# Altium project MainBoard.PrjPcb
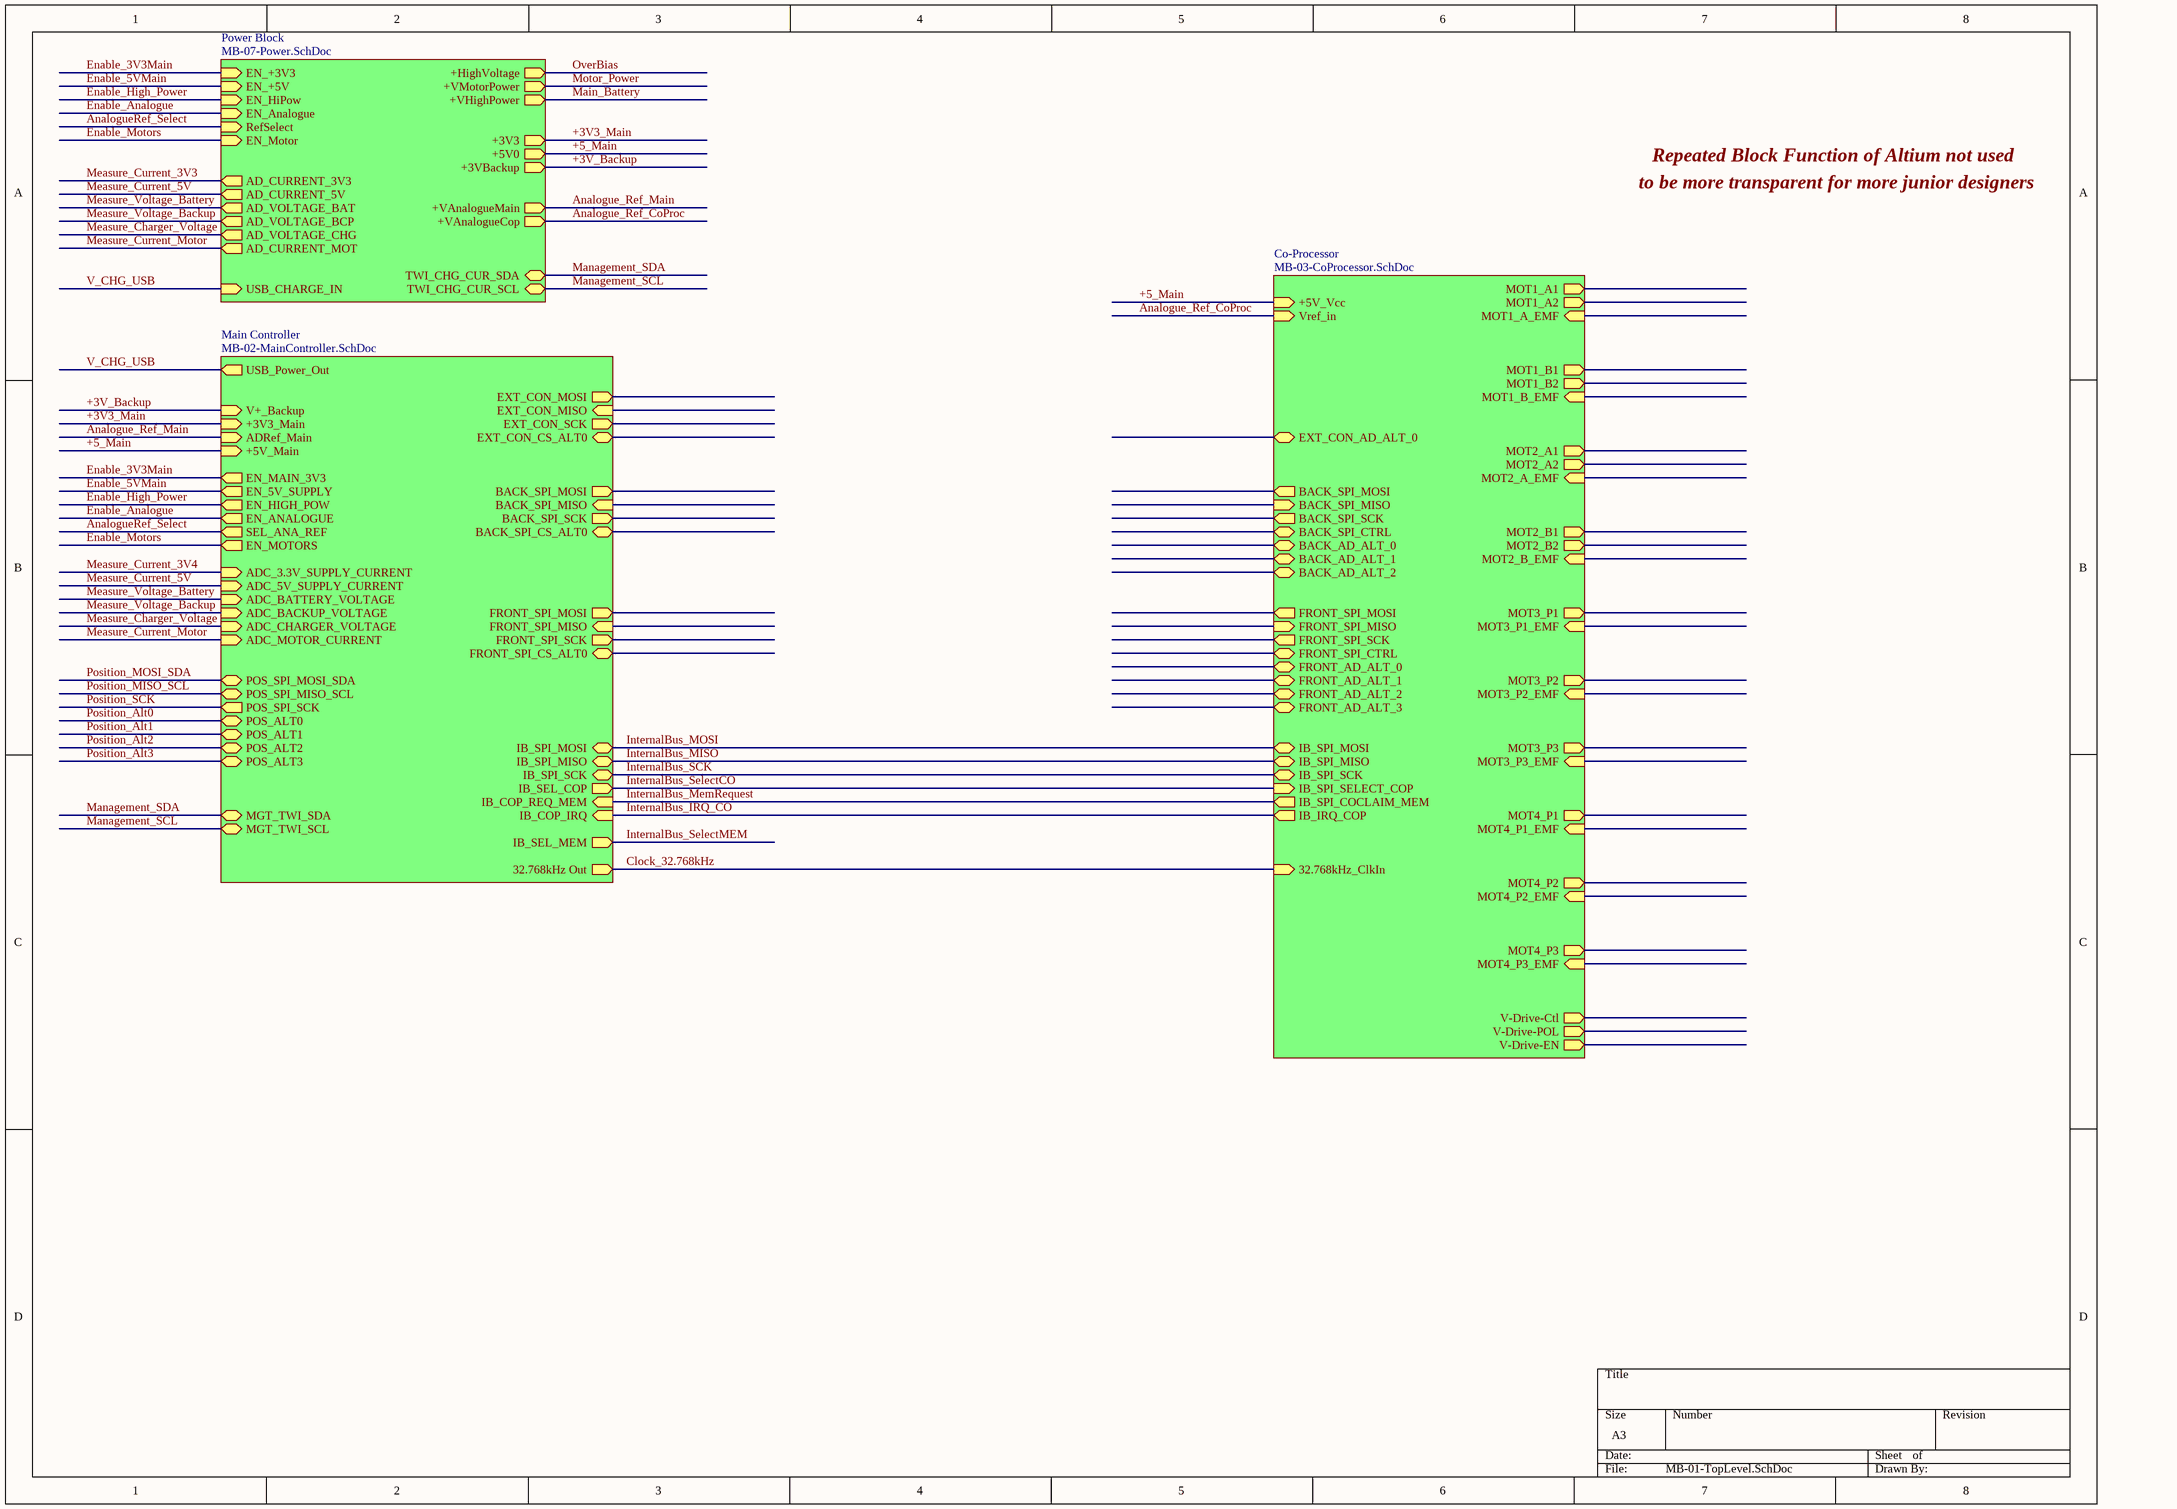
[diagram p0: MB-01-TopLevel.SchDoc]
13 sheets, 8 parts. Net scope: hierarchical (ports join the sheet entries above them; power ports are global).
Board file: MainBoard.PcbDoc
Sheets:
  MB-01-TopLevel.SchDoc
    Main Controller = MB-02-MainController.SchDoc
      USB-C-Connector = MB-06-USB-C.SchDoc
    Co-Processor = MB-03-CoProcessor.SchDoc
    Power Block = MB-07-Power.SchDoc
  MB-04-PositionSensors.SchDoc
  MB-05-FrontBay.SchDoc
  MB-08-Mot-Two_phase.SchDoc
    Phase A1 = MB-10-PhaseDrive-LowPow.SchDoc
    Phase A2 = MB-10-PhaseDrive-LowPow.SchDoc
    Phase B1 = MB-10-PhaseDrive-LowPow.SchDoc
    Phase B2 = MB-10-PhaseDrive-LowPow.SchDoc
  MB-09-Mot-Three_phase.SchDoc
    Phase 1 = MB-11-PhaseDrive-HiPow.SchDoc
    Phase 2 = MB-11-PhaseDrive-HiPow.SchDoc
    Phase 3 = MB-11-PhaseDrive-HiPow.SchDoc
  MB-12-BackBay.SchDoc
  MB-13-EXTCon.SchDoc

## Sheet MB-01-TopLevel.SchDoc
size A3

### Sub-sheets
Co-Processor = MB-03-CoProcessor.SchDoc: BACK_AD_ALT_1 (bidir), EXT_CON_AD_ALT_0 (bidir), BACK_AD_ALT_2 (bidir), BACK_AD_ALT_0 (bidir), FRONT_AD_ALT_3 (bidir), FRONT_AD_ALT_2 (bidir), FRONT_AD_ALT_1 (bidir), FRONT_AD_ALT_0 (bidir), BACK_SPI_SCK (out), BACK_SPI_MISO (in), BACK_SPI_MOSI (out), BACK_SPI_CTRL (bidir), FRONT_SPI_CTRL (bidir), FRONT_SPI_SCK (out), FRONT_SPI_MISO (in), FRONT_SPI_MOSI (out), +5V_Vcc (in), Vref_in (in), V-Drive-POL (out), V-Drive-EN (out), V-Drive-Ctl (out), MOT4_P3 (out), MOT4_P2 (out), MOT4_P1 (out), MOT3_P3 (out), MOT3_P2 (out), MOT3_P1 (out), MOT2_A1 (out), MOT1_B2 (out), MOT2_B2 (out), MOT2_B1 (out), MOT2_A2 (out), MOT1_B1 (out), MOT1_A2 (out), MOT1_A1 (out), 32.768kHz_ClkIn (in), IB_SPI_COCLAIM_MEM (out), IB_IRQ_COP (out), IB_SPI_SCK (bidir), IB_SPI_SELECT_COP (in), IB_SPI_MISO (bidir), IB_SPI_MOSI (bidir), MOT1_B_EMF (in), MOT1_A_EMF (in), MOT2_B_EMF (in), MOT3_P1_EMF (in), MOT2_A_EMF (in), MOT3_P2_EMF (in), MOT3_P3_EMF (in), MOT4_P1_EMF (in), MOT4_P2_EMF (in), MOT4_P3_EMF (in)
Main Controller = MB-02-MainController.SchDoc: ADC_BATTERY_VOLTAGE (in), BACK_SPI_SCK (out), USB_Power_Out (out), V+_Backup (in), +3V3_Main (in), ADRef_Main (in), ADC_MOTOR_CURRENT (in), +5V_Main (in), EXT_CON_SCK (out), EXT_CON_CS_ALT0 (bidir), EXT_CON_MOSI (out), EXT_CON_MISO (in), BACK_SPI_CS_ALT0 (bidir), BACK_SPI_MISO (in), BACK_SPI_MOSI (out), 32.768kHz Out (out), FRONT_SPI_SCK (out), FRONT_SPI_CS_ALT0 (bidir), FRONT_SPI_MOSI (out), FRONT_SPI_MISO (in), IB_COP_REQ_MEM (in), IB_SEL_MEM (out), IB_COP_IRQ (in), IB_SEL_COP (out), IB_SPI_MISO (bidir), IB_SPI_MOSI (bidir), IB_SPI_SCK (bidir), POS_ALT2 (bidir), POS_ALT3 (bidir), POS_ALT0 (bidir), POS_ALT1 (bidir), SEL_ANA_REF (out), EN_5V_SUPPLY (out), POS_SPI_MISO_SCL (bidir), POS_SPI_SCK (out), EN_HIGH_POW (out), POS_SPI_MOSI_SDA (bidir), EN_ANALOGUE (out), EN_MOTORS (out), ADC_3.3V_SUPPLY_CURRENT (in), ADC_BACKUP_VOLTAGE (in), ADC_CHARGER_VOLTAGE (in), EN_MAIN_3V3 (out), ADC_5V_SUPPLY_CURRENT (in), MGT_TWI_SDA (bidir), MGT_TWI_SCL (bidir)
Power Block = MB-07-Power.SchDoc: +VHighPower (out), EN_Motor (in), EN_Analogue (in), +VMotorPower (out), +3V3 (out), RefSelect (in), +5V0 (out), EN_+5V (in), +VAnalogueCop (out), +VAnalogueMain (out), +HighVoltage (out), EN_+3V3 (in), EN_HiPow (in), AD_VOLTAGE_BCP (out), USB_CHARGE_IN (in), AD_CURRENT_3V3 (out), AD_CURRENT_MOT (out), AD_CURRENT_5V (out), AD_VOLTAGE_BAT (out), AD_VOLTAGE_CHG (out), TWI_CHG_CUR_SCL (bidir), TWI_CHG_CUR_SDA (bidir), +3VBackup (out)

### Nets
+3V3_Main: sheet Main Controller/+3V3_Main, sheet Power Block/+3V3
+3V_Backup: sheet Main Controller/V+_Backup, sheet Power Block/+3VBackup
+5_Main: sheet Main Controller/+5V_Main, sheet Co-Processor/+5V_Vcc, sheet Power Block/+5V0
Analogue_Ref_CoProc: sheet Co-Processor/Vref_in, sheet Power Block/+VAnalogueCop
Analogue_Ref_Main: sheet Main Controller/ADRef_Main, sheet Power Block/+VAnalogueMain
AnalogueRef_Select: sheet Main Controller/SEL_ANA_REF, sheet Power Block/RefSelect
Clock_32.768kHz: sheet Main Controller/32.768kHz Out, sheet Co-Processor/32.768kHz_ClkIn  [project net 32.768kHz Bus]
Enable_3V3Main: sheet Main Controller/EN_MAIN_3V3, sheet Power Block/EN_+3V3
Enable_5VMain: sheet Main Controller/EN_5V_SUPPLY, sheet Power Block/EN_+5V
Enable_Analogue: sheet Main Controller/EN_ANALOGUE, sheet Power Block/EN_Analogue
Enable_High_Power: sheet Main Controller/EN_HIGH_POW, sheet Power Block/EN_HiPow
Enable_Motors: sheet Main Controller/EN_MOTORS, sheet Power Block/EN_Motor
InternalBus_IRQ_CO: sheet Main Controller/IB_COP_IRQ, sheet Co-Processor/IB_IRQ_COP
InternalBus_MemRequest: sheet Main Controller/IB_COP_REQ_MEM, sheet Co-Processor/IB_SPI_COCLAIM_MEM
InternalBus_MISO: sheet Main Controller/IB_SPI_MISO, sheet Co-Processor/IB_SPI_MISO
InternalBus_MOSI: sheet Main Controller/IB_SPI_MOSI, sheet Co-Processor/IB_SPI_MOSI
InternalBus_SCK: sheet Main Controller/IB_SPI_SCK, sheet Co-Processor/IB_SPI_SCK
InternalBus_SelectCO: sheet Main Controller/IB_SEL_COP, sheet Co-Processor/IB_SPI_SELECT_COP
Main_Battery: sheet Power Block/+VHighPower
Management_SCL: sheet Main Controller/MGT_TWI_SCL, sheet Power Block/TWI_CHG_CUR_SCL
Management_SDA: sheet Main Controller/MGT_TWI_SDA, sheet Power Block/TWI_CHG_CUR_SDA
Measure_Charger_Voltage: sheet Main Controller/ADC_CHARGER_VOLTAGE, sheet Power Block/AD_VOLTAGE_CHG
Measure_Current_3V3: sheet Power Block/AD_CURRENT_3V3
Measure_Current_5V: sheet Main Controller/ADC_5V_SUPPLY_CURRENT, sheet Power Block/AD_CURRENT_5V
Measure_Current_Motor: sheet Main Controller/ADC_MOTOR_CURRENT, sheet Power Block/AD_CURRENT_MOT
Measure_Voltage_Backup: sheet Main Controller/ADC_BACKUP_VOLTAGE, sheet Power Block/AD_VOLTAGE_BCP
Measure_Voltage_Battery: sheet Main Controller/ADC_BATTERY_VOLTAGE, sheet Power Block/AD_VOLTAGE_BAT
Motor_Power: sheet Power Block/+VMotorPower
OverBias: sheet Power Block/+HighVoltage
V_CHG_USB: sheet Main Controller/USB_Power_Out, sheet Power Block/USB_CHARGE_IN

### Notes on the sheet
- Repeated Block Function of Altium not used
- to be more transparent for more junior designers

## Sheet MB-02-MainController.SchDoc
size 330 x 228 mm
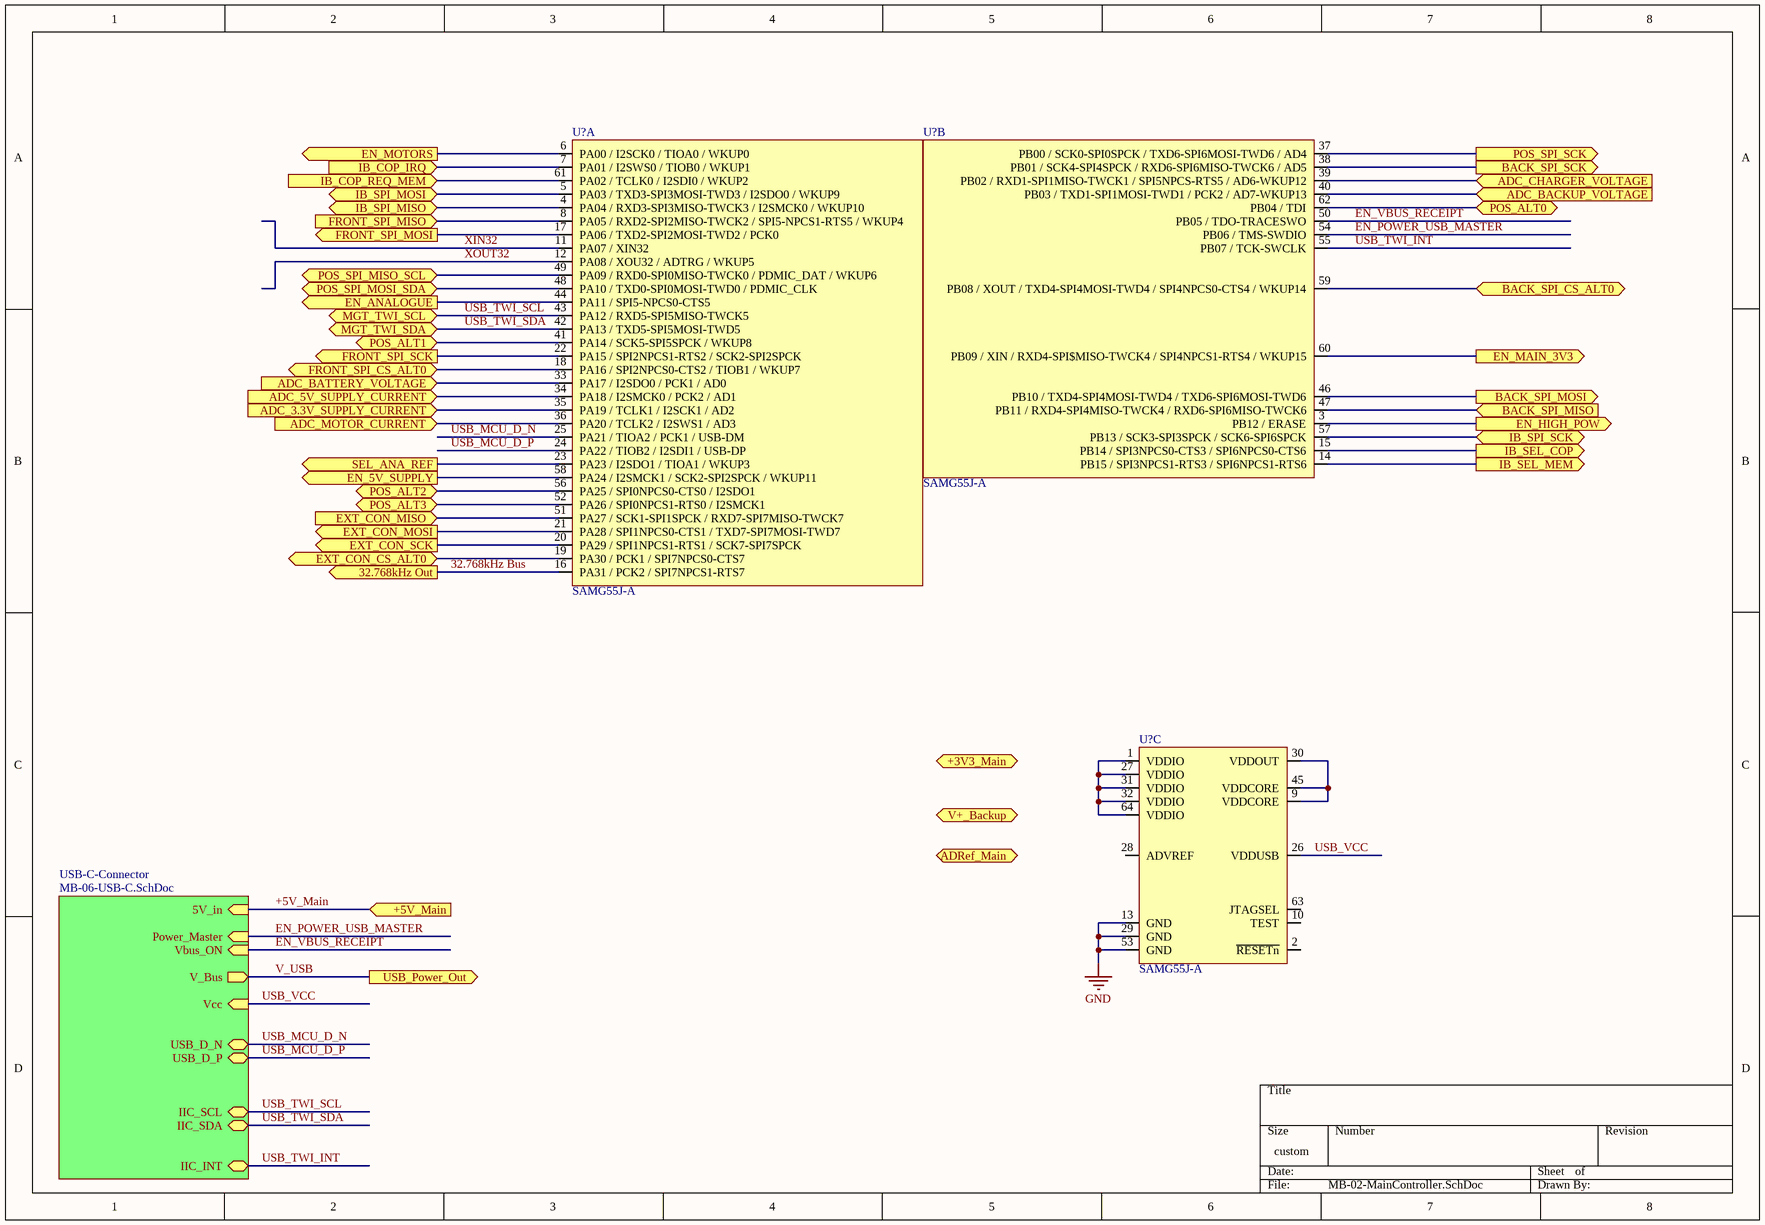
[diagram p1: MB-02-MainController.SchDoc]

### Parts
(Parts that share a designator on the sheet are numbered #1, #2 ... from top to bottom, then left to right.)
U?#1  SAMG55J-A  (part A of 3)
U?#2  SAMG55J-A  (part B of 3)
U?#3  SAMG55J-A  (part C of 3)

### Sub-sheets
USB-C-Connector = MB-06-USB-C.SchDoc: USB_D_P (bidir), USB_D_N (bidir), IIC_SCL (bidir), IIC_SDA (bidir), IIC_INT (bidir), V_Bus (out), Vcc (in), 5V_in (in), Power_Master (in), Vbus_ON (in)

### Ports
32.768kHz Out (out), +3V3_Main (in), +5V_Main (in), ADC_3.3V_SUPPLY_CURRENT (in), ADC_5V_SUPPLY_CURRENT (in), ADC_BACKUP_VOLTAGE (in), ADC_BATTERY_VOLTAGE (in), ADC_CHARGER_VOLTAGE (in), ADC_MOTOR_CURRENT (in), ADRef_Main (in), BACK_SPI_CS_ALT0 (bidir), BACK_SPI_MISO (in), BACK_SPI_MOSI (out), BACK_SPI_SCK (out), EN_5V_SUPPLY (out), EN_ANALOGUE (out), EN_HIGH_POW (out), EN_MAIN_3V3 (out), EN_MOTORS (out), EXT_CON_CS_ALT0 (bidir), EXT_CON_MISO (in), EXT_CON_MOSI (out), EXT_CON_SCK (out), FRONT_SPI_CS_ALT0 (bidir), FRONT_SPI_MISO (in), FRONT_SPI_MOSI (out), FRONT_SPI_SCK (out), IB_COP_IRQ (in), IB_COP_REQ_MEM (in), IB_SEL_COP (out), IB_SEL_MEM (out), IB_SPI_MISO (bidir), IB_SPI_MOSI (bidir), IB_SPI_SCK (bidir), MGT_TWI_SCL (bidir), MGT_TWI_SDA (bidir), POS_ALT0 (bidir), POS_ALT1 (bidir), POS_ALT2 (bidir), POS_ALT3 (bidir), POS_SPI_MISO_SCL (bidir), POS_SPI_MOSI_SDA (bidir), POS_SPI_SCK (out), SEL_ANA_REF (out), USB_Power_Out (out), V+_Backup (in)

### Nets
GND: U?#3.13(GND) U?#3.29(GND) U?#3.53(GND)
32.768kHz Bus: U?#1.16(PA31_/_PCK2_/_SPI7NPCS1-RTS7) ; port 32.768kHz Out
+5V_Main: port +5V_Main, sheet USB-C-Connector/5V_in  [project net +5_Main]
AnalogueRef_Select: U?#1.23(PA23_/_I2SDO1_/_TIOA1_/_WKUP3) ; port SEL_ANA_REF
EN_POWER_USB_MASTER: U?#2.54(PB06_/_TMS-SWDIO) ; sheet USB-C-Connector/Power_Master
EN_VBUS_RECEIPT: U?#2.50(PB05_/_TDO-TRACESWO) ; sheet USB-C-Connector/Vbus_ON
Enable_3V3Main: U?#2.60(PB09_/_XIN_/_RXD4-SPI$MISO-TWCK4_/_SPI4NPCS1-RTS4_/_WKUP15) ; port EN_MAIN_3V3
Enable_5VMain: U?#1.58(PA24_/_I2SMCK1_/_SCK2-SPI2SPCK_/_WKUP11) ; port EN_5V_SUPPLY
Enable_Analogue: U?#1.44(PA11_/_SPI5-NPCS0-CTS5) ; port EN_ANALOGUE
Enable_High_Power: U?#2.3(PB12_/_ERASE) ; port EN_HIGH_POW
Enable_Motors: U?#1.6(PA00_/_I2SCK0_/_TIOA0_/_WKUP0) ; port EN_MOTORS
InternalBus_IRQ_CO: U?#1.7(PA01_/_I2SWS0_/_TIOB0_/_WKUP1) ; port IB_COP_IRQ
InternalBus_MemRequest: U?#1.61(PA02_/_TCLK0_/_I2SDI0_/_WKUP2) ; port IB_COP_REQ_MEM
InternalBus_MISO: U?#1.4(PA04_/_RXD3-SPI3MISO-TWCK3_/_I2SMCK0_/_WKUP10) ; port IB_SPI_MISO
InternalBus_MOSI: U?#1.5(PA03_/_TXD3-SPI3MOSI-TWD3_/_I2SDO0_/_WKUP9) ; port IB_SPI_MOSI
InternalBus_SCK: U?#2.57(PB13_/_SCK3-SPI3SPCK_/_SCK6-SPI6SPCK) ; port IB_SPI_SCK
InternalBus_SelectCO: U?#2.15(PB14_/_SPI3NPCS0-CTS3_/_SPI6NPCS0-CTS6) ; port IB_SEL_COP
InternalBus_SelectMEM: U?#2.14(PB15_/_SPI3NPCS1-RTS3_/_SPI6NPCS1-RTS6) ; port IB_SEL_MEM
Measure_Charger_Voltage: U?#2.39(PB02_/_RXD1-SPI1MISO-TWCK1_/_SPI5NPCS-RTS5_/_AD6-WKUP12) ; port ADC_CHARGER_VOLTAGE
Measure_Current_3V4: U?#1.35(PA19_/_TCLK1_/_I2SCK1_/_AD2) ; port ADC_3.3V_SUPPLY_CURRENT
Measure_Current_5V: U?#1.34(PA18_/_I2SMCK0_/_PCK2_/_AD1) ; port ADC_5V_SUPPLY_CURRENT
Measure_Current_Motor: U?#1.36(PA20_/_TCLK2_/_I2SWS1_/_AD3) ; port ADC_MOTOR_CURRENT
Measure_Voltage_Backup: U?#2.40(PB03_/_TXD1-SPI1MOSI-TWD1_/_PCK2_/_AD7-WKUP13) ; port ADC_BACKUP_VOLTAGE
Measure_Voltage_Battery: U?#1.33(PA17_/_I2SDO0_/_PCK1_/_AD0) ; port ADC_BATTERY_VOLTAGE
Position_Alt0: U?#2.62(PB04_/_TDI) ; port POS_ALT0
Position_Alt1: U?#1.41(PA14_/_SCK5-SPI5SPCK_/_WKUP8) ; port POS_ALT1
Position_Alt2: U?#1.56(PA25_/_SPI0NPCS0-CTS0_/_I2SDO1) ; port POS_ALT2
Position_Alt3: U?#1.52(PA26_/_SPI0NPCS1-RTS0_/_I2SMCK1) ; port POS_ALT3
Position_MISO_SCL: U?#1.49(PA09_/_RXD0-SPI0MISO-TWCK0_/_PDMIC_DAT_/_WKUP6) ; port POS_SPI_MISO_SCL
Position_MOSI_SDA: U?#1.48(PA10_/_TXD0-SPI0MOSI-TWD0_/_PDMIC_CLK) ; port POS_SPI_MOSI_SDA
Position_SCK: U?#2.37(PB00_/_SCK0-SPI0SPCK_/_TXD6-SPI6MOSI-TWD6_/_AD4) ; port POS_SPI_SCK
USB_MCU_D_N: U?#1.25(PA21_/_TIOA2_/_PCK1_/_USB-DM) ; sheet USB-C-Connector/USB_D_N
USB_MCU_D_P: U?#1.24(PA22_/_TIOB2_/_I2SDI1_/_USB-DP) ; sheet USB-C-Connector/USB_D_P
USB_TWI_INT: U?#2.55(PB07_/_TCK-SWCLK) ; sheet USB-C-Connector/IIC_INT
USB_TWI_SCL: U?#1.43(PA12_/_RXD5-SPI5MISO-TWCK5) ; port MGT_TWI_SCL, sheet USB-C-Connector/IIC_SCL  [project net Management_SCL]
USB_TWI_SDA: U?#1.42(PA13_/_TXD5-SPI5MOSI-TWD5) ; port MGT_TWI_SDA, sheet USB-C-Connector/IIC_SDA  [project net Management_SDA]
USB_VCC: U?#3.26(VDDUSB) ; sheet USB-C-Connector/Vcc
V_USB: port USB_Power_Out, sheet USB-C-Connector/V_Bus  [project net V_CHG_USB]
XIN32: U?#1.11(PA07_/_XIN32)
XOUT32: U?#1.12(PA08_/_XOU32_/_ADTRG_/_WKUP5)
NetU?#1_8: U?#1.8(PA05_/_RXD2-SPI2MISO-TWCK2_/_SPI5-NPCS1-RTS5_/_WKUP4) ; port FRONT_SPI_MISO
NetU?#1_17: U?#1.17(PA06_/_TXD2-SPI2MOSI-TWD2_/_PCK0) ; port FRONT_SPI_MOSI
NetU?#1_18: U?#1.18(PA16_/_SPI2NPCS0-CTS2_/_TIOB1_/_WKUP7) ; port FRONT_SPI_CS_ALT0
NetU?#1_19: U?#1.19(PA30_/_PCK1_/_SPI7NPCS0-CTS7) ; port EXT_CON_CS_ALT0
NetU?#1_20: U?#1.20(PA29_/_SPI1NPCS1-RTS1_/_SCK7-SPI7SPCK) ; port EXT_CON_SCK
NetU?#1_21: U?#1.21(PA28_/_SPI1NPCS0-CTS1_/_TXD7-SPI7MOSI-TWD7) ; port EXT_CON_MOSI
NetU?#1_22: U?#1.22(PA15_/_SPI2NPCS1-RTS2_/_SCK2-SPI2SPCK) ; port FRONT_SPI_SCK
NetU?#1_51: U?#1.51(PA27_/_SCK1-SPI1SPCK_/_RXD7-SPI7MISO-TWCK7) ; port EXT_CON_MISO
NetU?#2_38: U?#2.38(PB01_/_SCK4-SPI4SPCK_/_RXD6-SPI6MISO-TWCK6_/_AD5) ; port BACK_SPI_SCK
NetU?#2_46: U?#2.46(PB10_/_TXD4-SPI4MOSI-TWD4_/_TXD6-SPI6MOSI-TWD6) ; port BACK_SPI_MOSI
NetU?#2_47: U?#2.47(PB11_/_RXD4-SPI4MISO-TWCK4_/_RXD6-SPI6MISO-TWCK6) ; port BACK_SPI_MISO
NetU?#2_59: U?#2.59(PB08_/_XOUT_/_TXD4-SPI4MOSI-TWD4_/_SPI4NPCS0-CTS4_/_WKUP14) ; port BACK_SPI_CS_ALT0
NetU?#3_1: U?#3.1(VDDIO) U?#3.27(VDDIO) U?#3.31(VDDIO) U?#3.32(VDDIO) U?#3.64(VDDIO)
NetU?#3_9: U?#3.9(VDDCORE) U?#3.30(VDDOUT) U?#3.45(VDDCORE)

Not connected (* = marked no-connect by the designer): U?#3 2(~{RESETn}) 10(TEST) 28(ADVREF) 63(JTAGSEL)

### Library data of the parts
U?#1-U?#3 = CHIP_ATM_SAMG55J-A: Atmel ARM Cortex M4, 64pin QFP

## Sheet MB-06-USB-C.SchDoc
size A4
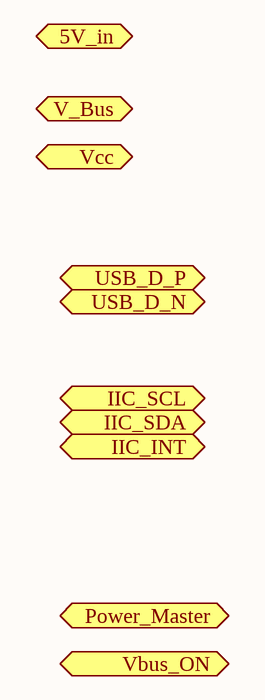
[diagram p2: MB-06-USB-C.SchDoc]

### Ports
5V_in (in), IIC_INT (bidir), IIC_SCL (bidir), IIC_SDA (bidir), Power_Master (in), USB_D_N (bidir), USB_D_P (bidir), V_Bus (out), Vbus_ON (in), Vcc (in)

## Sheet MB-03-CoProcessor.SchDoc
size 304 x 228 mm
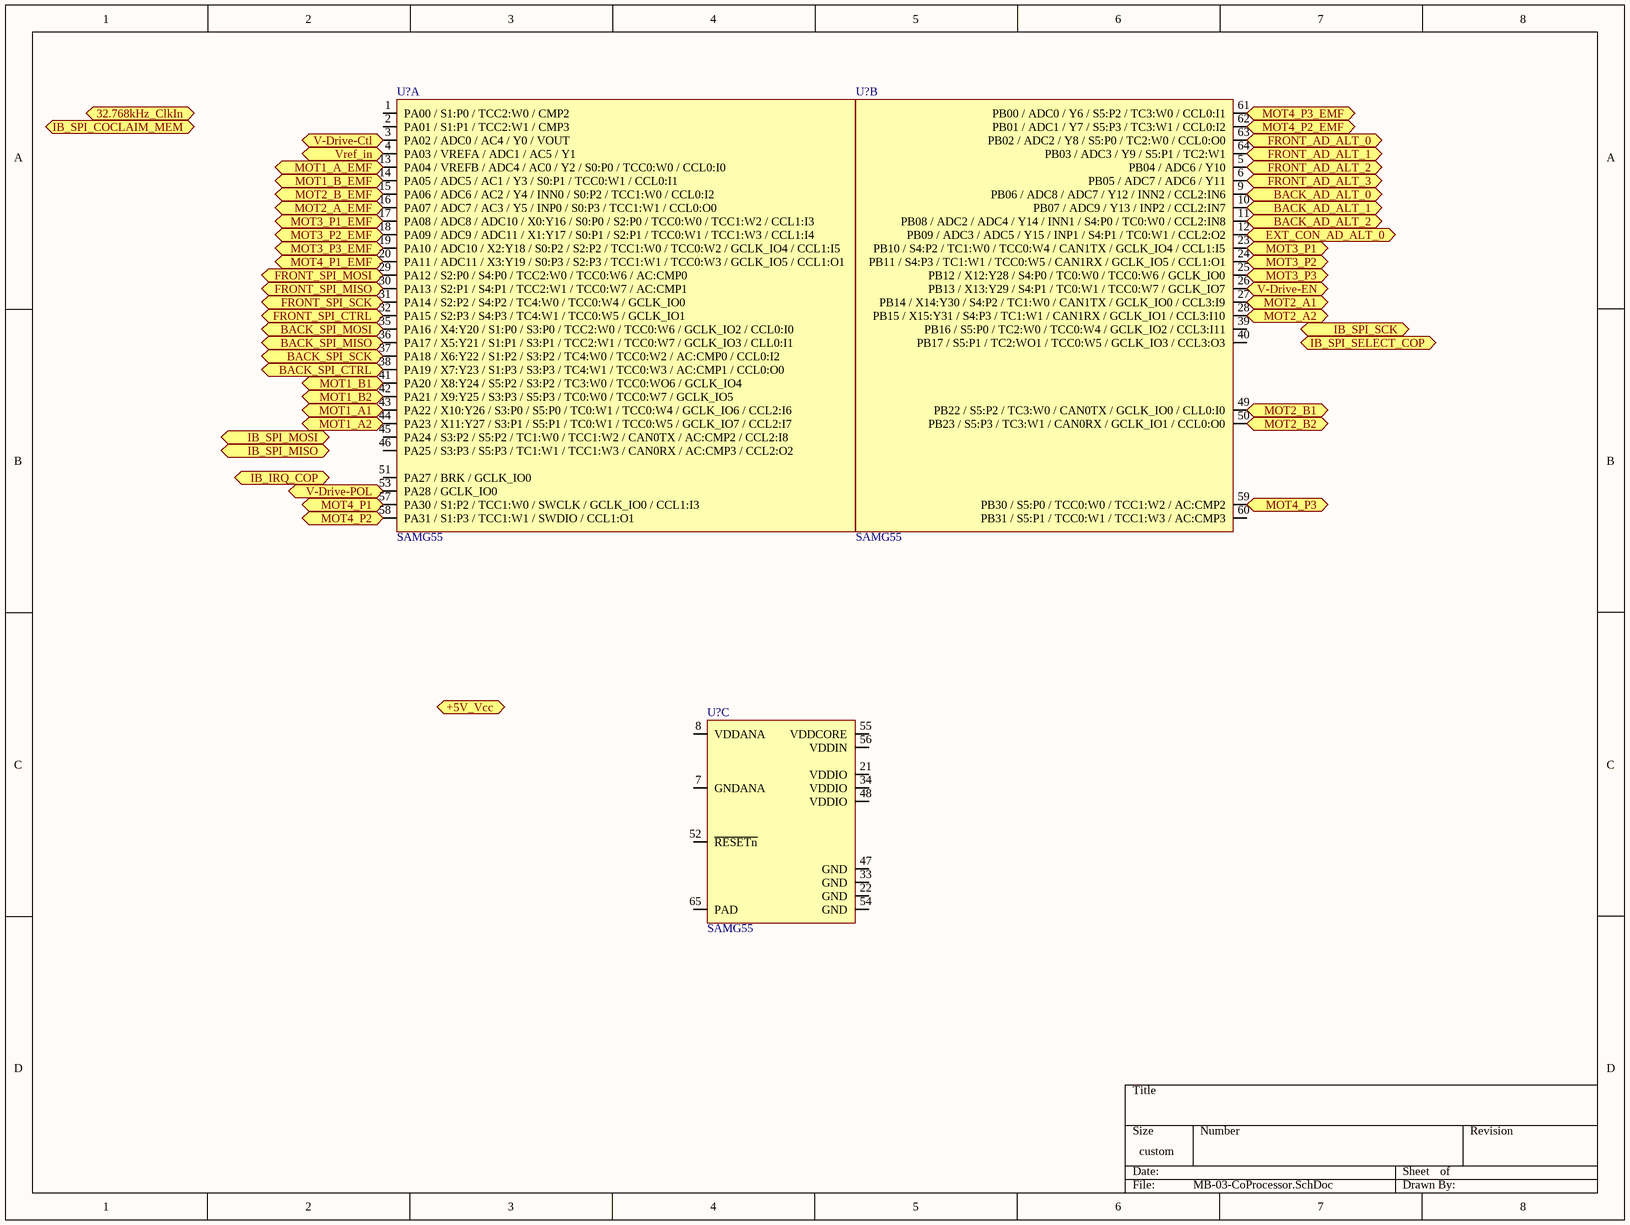
[diagram p3: MB-03-CoProcessor.SchDoc]

### Parts
(Parts that share a designator on the sheet are numbered #1, #2 ... from top to bottom, then left to right.)
U?#4  SAMG55  (part A of 3)
U?#5  SAMG55  (part B of 3)
U?#6  SAMG55  (part C of 3)

### Ports
32.768kHz_ClkIn (in), +5V_Vcc (in), BACK_AD_ALT_0 (bidir), BACK_AD_ALT_1 (bidir), BACK_AD_ALT_2 (bidir), BACK_SPI_CTRL (bidir), BACK_SPI_MISO (in), BACK_SPI_MOSI (out), BACK_SPI_SCK (out), EXT_CON_AD_ALT_0 (bidir), FRONT_AD_ALT_0 (bidir), FRONT_AD_ALT_1 (bidir), FRONT_AD_ALT_2 (bidir), FRONT_AD_ALT_3 (bidir), FRONT_SPI_CTRL (bidir), FRONT_SPI_MISO (in), FRONT_SPI_MOSI (out), FRONT_SPI_SCK (out), IB_IRQ_COP (out), IB_SPI_COCLAIM_MEM (out), IB_SPI_MISO (bidir), IB_SPI_MOSI (bidir), IB_SPI_SCK (bidir), IB_SPI_SELECT_COP (in), MOT1_A1 (out), MOT1_A2 (out), MOT1_A_EMF (in), MOT1_B1 (out), MOT1_B2 (out), MOT1_B_EMF (in), MOT2_A1 (out), MOT2_A2 (out), MOT2_A_EMF (in), MOT2_B1 (out), MOT2_B2 (out), MOT2_B_EMF (in), MOT3_P1 (out), MOT3_P1_EMF (in), MOT3_P2 (out), MOT3_P2_EMF (in), MOT3_P3 (out), MOT3_P3_EMF (in), MOT4_P1 (out), MOT4_P1_EMF (in), MOT4_P2 (out), MOT4_P2_EMF (in), MOT4_P3 (out), MOT4_P3_EMF (in), V-Drive-Ctl (out), V-Drive-EN (out), V-Drive-POL (out), Vref_in (in)

### Nets
Analogue_Ref_CoProc: U?#4.4(PA03_/_VREFA_/_ADC1_/_AC5_/_Y1) ; port Vref_in
NetU?#4_3: U?#4.3(PA02_/_ADC0_/_AC4_/_Y0_/_VOUT) ; port V-Drive-Ctl
NetU?#4_13: U?#4.13(PA04_/_VREFB_/_ADC4_/_AC0_/_Y2_/_S0:P0_/_TCC0:W0_/_CCL0:I0) ; port MOT1_A_EMF
NetU?#4_14: U?#4.14(PA05_/_ADC5_/_AC1_/_Y3_/_S0:P1_/_TCC0:W1_/_CCL0:I1) ; port MOT1_B_EMF
NetU?#4_15: U?#4.15(PA06_/_ADC6_/_AC2_/_Y4_/_INN0_/_S0:P2_/_TCC1:W0_/_CCL0:I2) ; port MOT2_B_EMF
NetU?#4_16: U?#4.16(PA07_/_ADC7_/_AC3_/_Y5_/_INP0_/_S0:P3_/_TCC1:W1_/_CCL0:O0) ; port MOT2_A_EMF
NetU?#4_17: U?#4.17(PA08_/_ADC8_/_ADC10_/_X0:Y16_/_S0:P0_/_S2:P0_/_TCC0:W0_/_TCC1:W2_/_CCL1:I3) ; port MOT3_P1_EMF
NetU?#4_18: U?#4.18(PA09_/_ADC9_/_ADC11_/_X1:Y17_/_S0:P1_/_S2:P1_/_TCC0:W1_/_TCC1:W3_/_CCL1:I4) ; port MOT3_P2_EMF
NetU?#4_19: U?#4.19(PA10_/_ADC10_/_X2:Y18_/_S0:P2_/_S2:P2_/_TCC1:W0_/_TCC0:W2_/_GCLK_IO4_/_CCL1:I5) ; port MOT3_P3_EMF
NetU?#4_20: U?#4.20(PA11_/_ADC11_/_X3:Y19_/_S0:P3_/_S2:P3_/_TCC1:W1_/_TCC0:W3_/_GCLK_IO5_/_CCL1:O1) ; port MOT4_P1_EMF
NetU?#4_29: U?#4.29(PA12_/_S2:P0_/_S4:P0_/_TCC2:W0_/_TCC0:W6_/_AC:CMP0) ; port FRONT_SPI_MOSI
NetU?#4_30: U?#4.30(PA13_/_S2:P1_/_S4:P1_/_TCC2:W1_/_TCC0:W7_/_AC:CMP1) ; port FRONT_SPI_MISO
NetU?#4_31: U?#4.31(PA14_/_S2:P2_/_S4:P2_/_TC4:W0_/_TCC0:W4_/_GCLK_IO0) ; port FRONT_SPI_SCK
NetU?#4_32: U?#4.32(PA15_/_S2:P3_/_S4:P3_/_TC4:W1_/_TCC0:W5_/_GCLK_IO1) ; port FRONT_SPI_CTRL
NetU?#4_35: U?#4.35(PA16_/_X4:Y20_/_S1:P0_/_S3:P0_/_TCC2:W0_/_TCC0:W6_/_GCLK_IO2_/_CCL0:I0) ; port BACK_SPI_MOSI
NetU?#4_36: U?#4.36(PA17_/_X5:Y21_/_S1:P1_/_S3:P1_/_TCC2:W1_/_TCC0:W7_/_GCLK_IO3_/_CLL0:I1) ; port BACK_SPI_MISO
NetU?#4_37: U?#4.37(PA18_/_X6:Y22_/_S1:P2_/_S3:P2_/_TC4:W0_/_TCC0:W2_/_AC:CMP0_/_CCL0:I2) ; port BACK_SPI_SCK
NetU?#4_38: U?#4.38(PA19_/_X7:Y23_/_S1:P3_/_S3:P3_/_TC4:W1_/_TCC0:W3_/_AC:CMP1_/_CCL0:O0) ; port BACK_SPI_CTRL
NetU?#4_41: U?#4.41(PA20_/_X8:Y24_/_S5:P2_/_S3:P2_/_TC3:W0_/_TCC0:WO6_/_GCLK_IO4) ; port MOT1_B1
NetU?#4_42: U?#4.42(PA21_/_X9:Y25_/_S3:P3_/_S5:P3_/_TC0:W0_/_TCC0:W7_/_GCLK_IO5) ; port MOT1_B2
NetU?#4_43: U?#4.43(PA22_/_X10:Y26_/_S3:P0_/_S5:P0_/_TC0:W1_/_TCC0:W4_/_GCLK_IO6_/_CCL2:I6) ; port MOT1_A1
NetU?#4_44: U?#4.44(PA23_/_X11:Y27_/_S3:P1_/_S5:P1_/_TC0:W1_/_TCC0:W5_/_GCLK_IO7_/_CCL2:I7) ; port MOT1_A2
NetU?#4_53: U?#4.53(PA28_/_GCLK_IO0) ; port V-Drive-POL
NetU?#4_57: U?#4.57(PA30_/_S1:P2_/_TCC1:W0_/_SWCLK_/_GCLK_IO0_/_CCL1:I3) ; port MOT4_P1
NetU?#4_58: U?#4.58(PA31_/_S1:P3_/_TCC1:W1_/_SWDIO_/_CCL1:O1) ; port MOT4_P2
NetU?#5_5: U?#5.5(PB04_/_ADC6_/_Y10) ; port FRONT_AD_ALT_2
NetU?#5_6: U?#5.6(PB05_/_ADC7_/_ADC6_/_Y11) ; port FRONT_AD_ALT_3
NetU?#5_9: U?#5.9(PB06_/_ADC8_/_ADC7_/_Y12_/_INN2_/_CCL2:IN6) ; port BACK_AD_ALT_0
NetU?#5_10: U?#5.10(PB07_/_ADC9_/_Y13_/_INP2_/_CCL2:IN7) ; port BACK_AD_ALT_1
NetU?#5_11: U?#5.11(PB08_/_ADC2_/_ADC4_/_Y14_/_INN1_/_S4:P0_/_TC0:W0_/_CCL2:IN8) ; port BACK_AD_ALT_2
NetU?#5_12: U?#5.12(PB09_/_ADC3_/_ADC5_/_Y15_/_INP1_/_S4:P1_/_TC0:W1_/_CCL2:O2) ; port EXT_CON_AD_ALT_0
NetU?#5_23: U?#5.23(PB10_/_S4:P2_/_TC1:W0_/_TCC0:W4_/_CAN1TX_/_GCLK_IO4_/_CCL1:I5) ; port MOT3_P1
NetU?#5_24: U?#5.24(PB11_/_S4:P3_/_TC1:W1_/_TCC0:W5_/_CAN1RX_/_GCLK_IO5_/_CCL1:O1) ; port MOT3_P2
NetU?#5_25: U?#5.25(PB12_/_X12:Y28_/_S4:P0_/_TC0:W0_/_TCC0:W6_/_GCLK_IO0) ; port MOT3_P3
NetU?#5_26: U?#5.26(PB13_/_X13:Y29_/_S4:P1_/_TC0:W1_/_TCC0:W7_/_GCLK_IO7) ; port V-Drive-EN
NetU?#5_27: U?#5.27(PB14_/_X14:Y30_/_S4:P2_/_TC1:W0_/_CAN1TX_/_GCLK_IO0_/_CCL3:I9) ; port MOT2_A1
NetU?#5_28: U?#5.28(PB15_/_X15:Y31_/_S4:P3_/_TC1:W1_/_CAN1RX_/_GCLK_IO1_/_CCL3:I10) ; port MOT2_A2
NetU?#5_49: U?#5.49(PB22_/_S5:P2_/_TC3:W0_/_CAN0TX_/_GCLK_IO0_/_CLL0:I0) ; port MOT2_B1
NetU?#5_50: U?#5.50(PB23_/_S5:P3_/_TC3:W1_/_CAN0RX_/_GCLK_IO1_/_CCL0:O0) ; port MOT2_B2
NetU?#5_59: U?#5.59(PB30_/_S5:P0_/_TCC0:W0_/_TCC1:W2_/_AC:CMP2) ; port MOT4_P3
NetU?#5_61: U?#5.61(PB00_/_ADC0_/_Y6_/_S5:P2_/_TC3:W0_/_CCL0:I1) ; port MOT4_P3_EMF
NetU?#5_62: U?#5.62(PB01_/_ADC1_/_Y7_/_S5:P3_/_TC3:W1_/_CCL0:I2) ; port MOT4_P2_EMF
NetU?#5_63: U?#5.63(PB02_/_ADC2_/_Y8_/_S5:P0_/_TC2:W0_/_CCL0:O0) ; port FRONT_AD_ALT_0
NetU?#5_64: U?#5.64(PB03_/_ADC3_/_Y9_/_S5:P1_/_TC2:W1) ; port FRONT_AD_ALT_1

Not connected (* = marked no-connect by the designer): U?#4 1(PA00_/_S1:P0_/_TCC2:W0_/_CMP2) 2(PA01_/_S1:P1_/_TCC2:W1_/_CMP3) 45(PA24_/_S3:P2_/_S5:P2_/_TC1:W0_/_TCC1:W2_/_CAN0TX_/_AC:CMP2_/_CCL2:I8) 46(PA25_/_S3:P3_/_S5:P3_/_TC1:W1_/_TCC1:W3_/_CAN0RX_/_AC:CMP3_/_CCL2:O2) 51(PA27_/_BRK_/_GCLK_IO0); U?#5 39(PB16_/_S5:P0_/_TC2:W0_/_TCC0:W4_/_GCLK_IO2_/_CCL3:I11) 40(PB17_/_S5:P1_/_TC2:WO1_/_TCC0:W5_/_GCLK_IO3_/_CCL3:O3) 60(PB31_/_S5:P1_/_TCC0:W1_/_TCC1:W3_/_AC:CMP3); U?#6 7(GNDANA) 8(VDDANA) 21(VDDIO) 22(GND) 33(GND) 34(VDDIO) 47(GND) 48(VDDIO) 52(~{RESETn}) 54(GND) 55(VDDCORE) 56(VDDIN) 65(PAD)

### Library data of the parts
U?#4-U?#6 = CHIP_ATM_SAMC21J-M: Atmel ARM M0+ 64pin SAMC21

## Sheet MB-07-Power.SchDoc
size A4
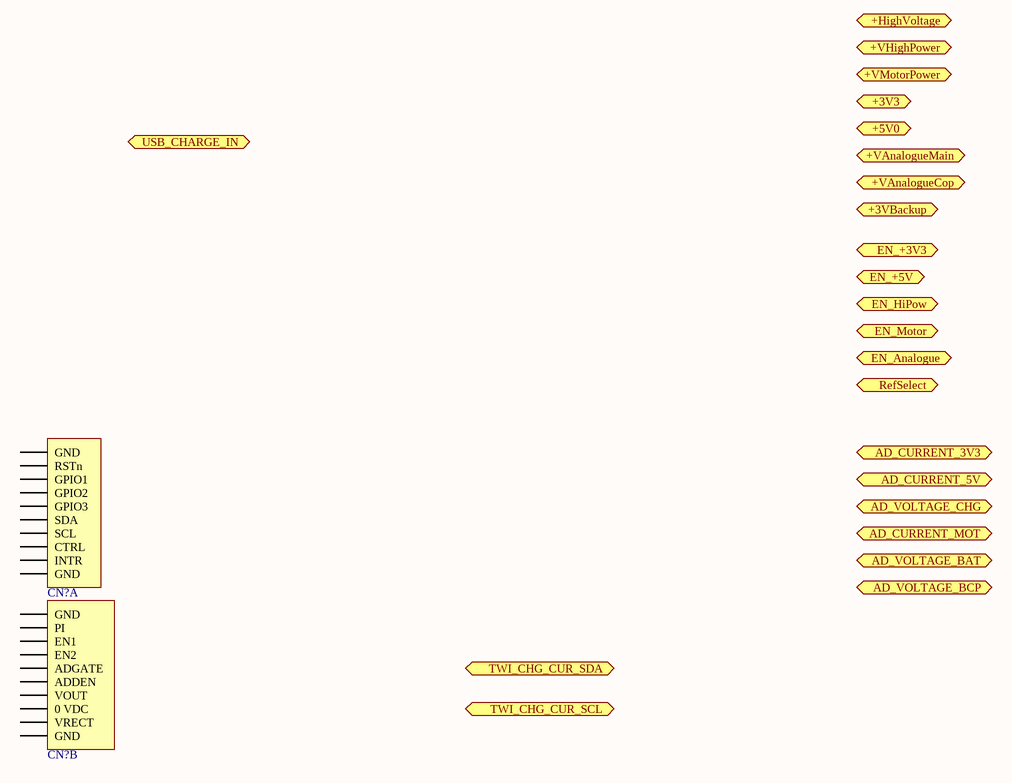
[diagram p4: MB-07-Power.SchDoc]

### Parts
(Parts that share a designator on the sheet are numbered #1, #2 ... from top to bottom, then left to right.)
CN?#1  WirelessPower  [CON_WE_WirelessPower]  (value not drawn)  (part A of 2)
CN?#2  WirelessPower  [CON_WE_WirelessPower]  (value not drawn)  (part B of 2)

### Ports
+3V3 (out), +3VBackup (out), +5V0 (out), +HighVoltage (out), +VAnalogueCop (out), +VAnalogueMain (out), +VHighPower (out), +VMotorPower (out), AD_CURRENT_3V3 (out), AD_CURRENT_5V (out), AD_CURRENT_MOT (out), AD_VOLTAGE_BAT (out), AD_VOLTAGE_BCP (out), AD_VOLTAGE_CHG (out), EN_+3V3 (in), EN_+5V (in), EN_Analogue (in), EN_HiPow (in), EN_Motor (in), RefSelect (in), TWI_CHG_CUR_SCL (bidir), TWI_CHG_CUR_SDA (bidir), USB_CHARGE_IN (in)

### Nets

Not connected (* = marked no-connect by the designer): CN?#1 11(GND) 12(RSTn) 13(GPIO1) 14(GPIO2) 15(GPIO3) 16(SDA) 17(SCL) 18(CTRL) 19(INTR) 20(GND); CN?#2 1(GND) 2(PI) 3(EN1) 4(EN2) 5(ADGATE) 6(ADDEN) 7(VOUT) 8(0_VDC) 9(VRECT) 10(GND)

### Library data of the parts
CN?#1 CN?#2 = CON_WE_WirelessPower: Wurth Elektronik Wireless Power Experimenter Receiver Footprint; Constituant Part 1: *; Constituant Part 1 Count: *; Constituant Part 2: *; Constituant Part 2 Count: *; Constituant Part 3: *; Constituant Part 3 Count: *

## Sheet MB-04-PositionSensors.SchDoc
size A4

## Sheet MB-05-FrontBay.SchDoc
size A4
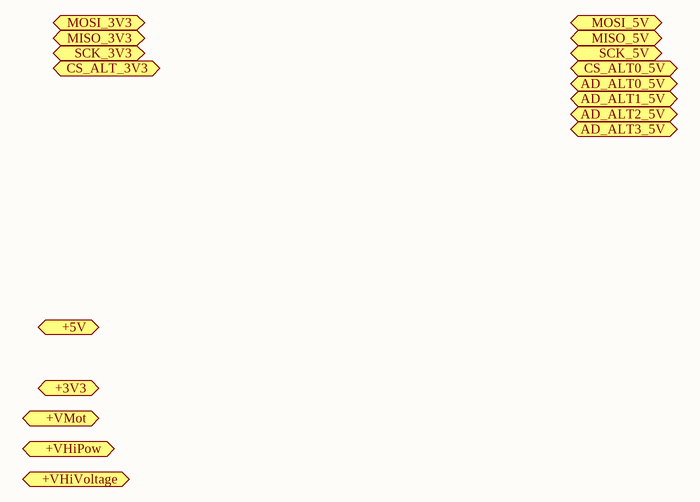
[diagram p5: MB-05-FrontBay.SchDoc]

### Ports
+3V3 (in), +5V (in), +VHiPow (in), +VHiVoltage (in), +VMot (in), AD_ALT0_5V (bidir), AD_ALT1_5V (bidir), AD_ALT2_5V (bidir), AD_ALT3_5V (bidir), CS_ALT0_5V (bidir), CS_ALT_3V3 (bidir), MISO_3V3 (out), MISO_5V (out), MOSI_3V3 (in), MOSI_5V (in), SCK_3V3 (in), SCK_5V (in)

## Sheet MB-08-Mot-Two_phase.SchDoc
size A4
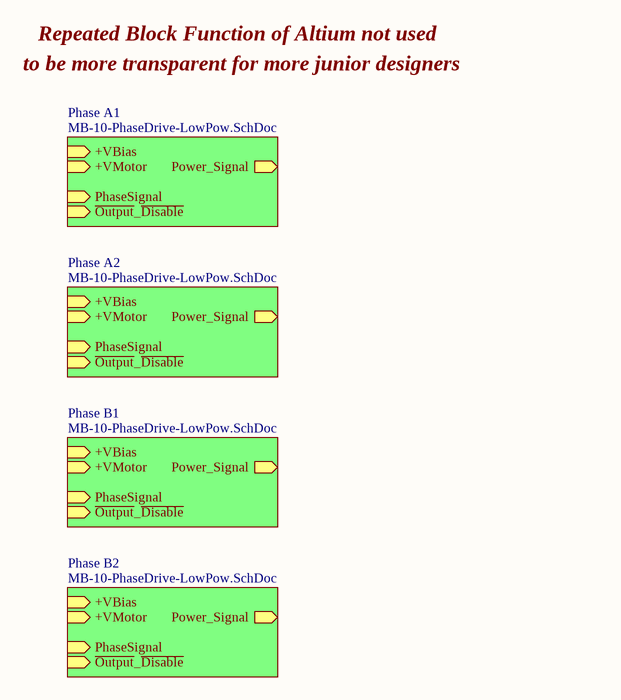
[diagram p6: MB-08-Mot-Two_phase.SchDoc]

### Sub-sheets
Phase A1 = MB-10-PhaseDrive-LowPow.SchDoc: PhaseSignal (in), ~{Output}_~{Disable} (in), +VMotor (in), +VBias (in), Power_Signal (out)
Phase A2 = MB-10-PhaseDrive-LowPow.SchDoc: PhaseSignal (in), ~{Output}_~{Disable} (in), +VMotor (in), +VBias (in), Power_Signal (out)
Phase B1 = MB-10-PhaseDrive-LowPow.SchDoc: PhaseSignal (in), ~{Output}_~{Disable} (in), +VMotor (in), +VBias (in), Power_Signal (out)
Phase B2 = MB-10-PhaseDrive-LowPow.SchDoc: PhaseSignal (in), ~{Output}_~{Disable} (in), +VMotor (in), +VBias (in), Power_Signal (out)

### Notes on the sheet
- to be more transparent for more junior designers
- Repeated Block Function of Altium not used

## Sheet MB-10-PhaseDrive-LowPow.SchDoc
size A4
Used 4 times, as channels Phase A1, Phase A2, Phase B1, Phase B2. Parts and nets are listed once, with the designators drawn on the sheet.
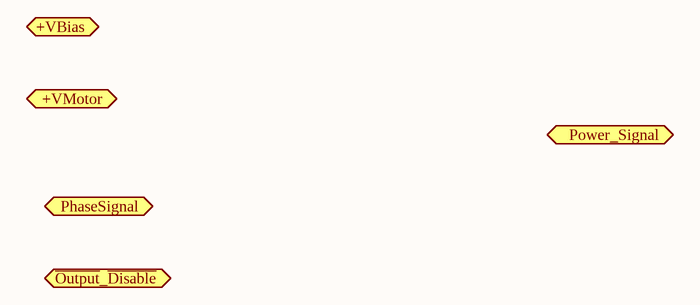
[diagram p7: MB-10-PhaseDrive-LowPow.SchDoc]

### Ports
+VBias (in), +VMotor (in), PhaseSignal (in), Power_Signal (out), ~{Output}_~{Disable} (in)

### Channels
Phase A1: ports +VBias=open +VMotor=open PhaseSignal=open Power_Signal=open ~{Output}_~{Disable}=open
Phase A2: ports +VBias=open +VMotor=open PhaseSignal=open Power_Signal=open ~{Output}_~{Disable}=open
Phase B1: ports +VBias=open +VMotor=open PhaseSignal=open Power_Signal=open ~{Output}_~{Disable}=open
Phase B2: ports +VBias=open +VMotor=open PhaseSignal=open Power_Signal=open ~{Output}_~{Disable}=open

## Sheet MB-09-Mot-Three_phase.SchDoc
size A4
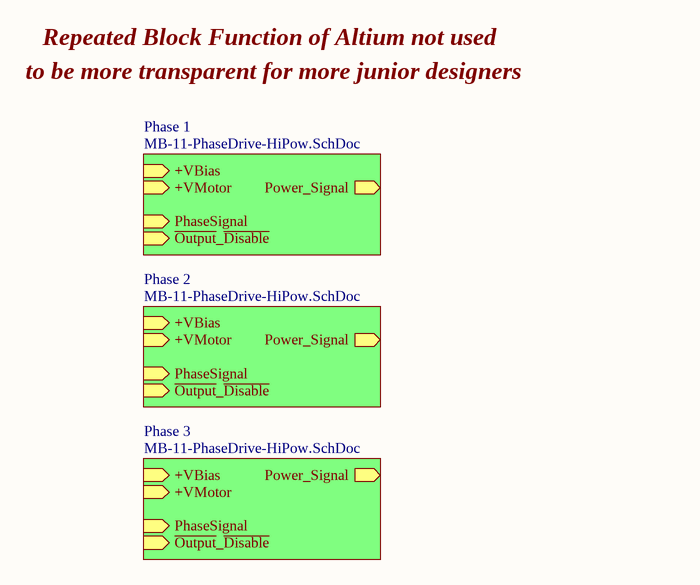
[diagram p8: MB-09-Mot-Three_phase.SchDoc]

### Sub-sheets
Phase 1 = MB-11-PhaseDrive-HiPow.SchDoc: +VMotor (in), +VBias (in), Power_Signal (out), ~{Output}_~{Disable} (in), PhaseSignal (in)
Phase 2 = MB-11-PhaseDrive-HiPow.SchDoc: +VMotor (in), +VBias (in), Power_Signal (out), ~{Output}_~{Disable} (in), PhaseSignal (in)
Phase 3 = MB-11-PhaseDrive-HiPow.SchDoc: +VMotor (in), +VBias (in), Power_Signal (out), ~{Output}_~{Disable} (in), PhaseSignal (in)

### Notes on the sheet
- to be more transparent for more junior designers
- Repeated Block Function of Altium not used

## Sheet MB-11-PhaseDrive-HiPow.SchDoc
size A4
Used 3 times, as channels Phase 1, Phase 2, Phase 3. Parts and nets are listed once, with the designators drawn on the sheet.
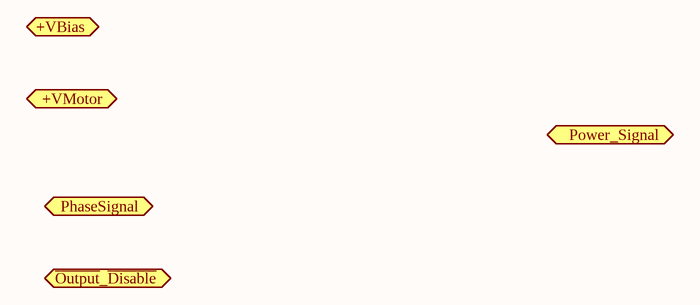
[diagram p9: MB-11-PhaseDrive-HiPow.SchDoc]

### Ports
+VBias (in), +VMotor (in), PhaseSignal (in), Power_Signal (out), ~{Output}_~{Disable} (in)

### Channels
Phase 1: ports +VBias=open +VMotor=open PhaseSignal=open Power_Signal=open ~{Output}_~{Disable}=open
Phase 2: ports +VBias=open +VMotor=open PhaseSignal=open Power_Signal=open ~{Output}_~{Disable}=open
Phase 3: ports +VBias=open +VMotor=open PhaseSignal=open Power_Signal=open ~{Output}_~{Disable}=open

## Sheet MB-12-BackBay.SchDoc
size A4
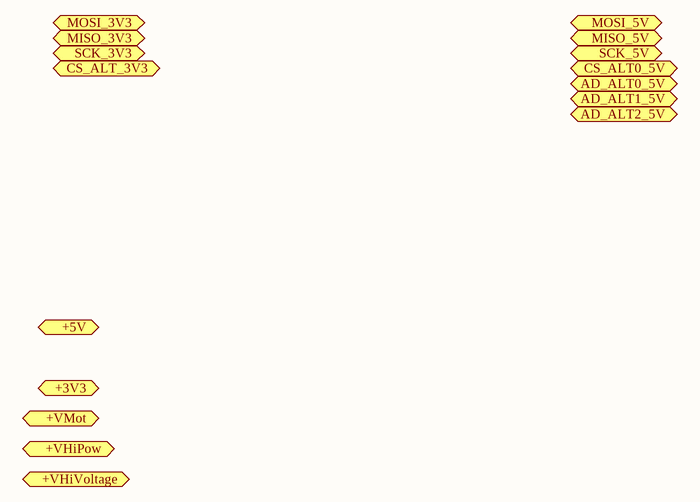
[diagram p10: MB-12-BackBay.SchDoc]

### Ports
+3V3 (in), +5V (in), +VHiPow (in), +VHiVoltage (in), +VMot (in), AD_ALT0_5V (bidir), AD_ALT1_5V (bidir), AD_ALT2_5V (bidir), CS_ALT0_5V (bidir), CS_ALT_3V3 (bidir), MISO_3V3 (out), MISO_5V (out), MOSI_3V3 (in), MOSI_5V (in), SCK_3V3 (in), SCK_5V (in)

## Sheet MB-13-EXTCon.SchDoc
size A4